# EAGLE design ESP_LoRa_Weather_1.55 (EAGLE 9.6.2)
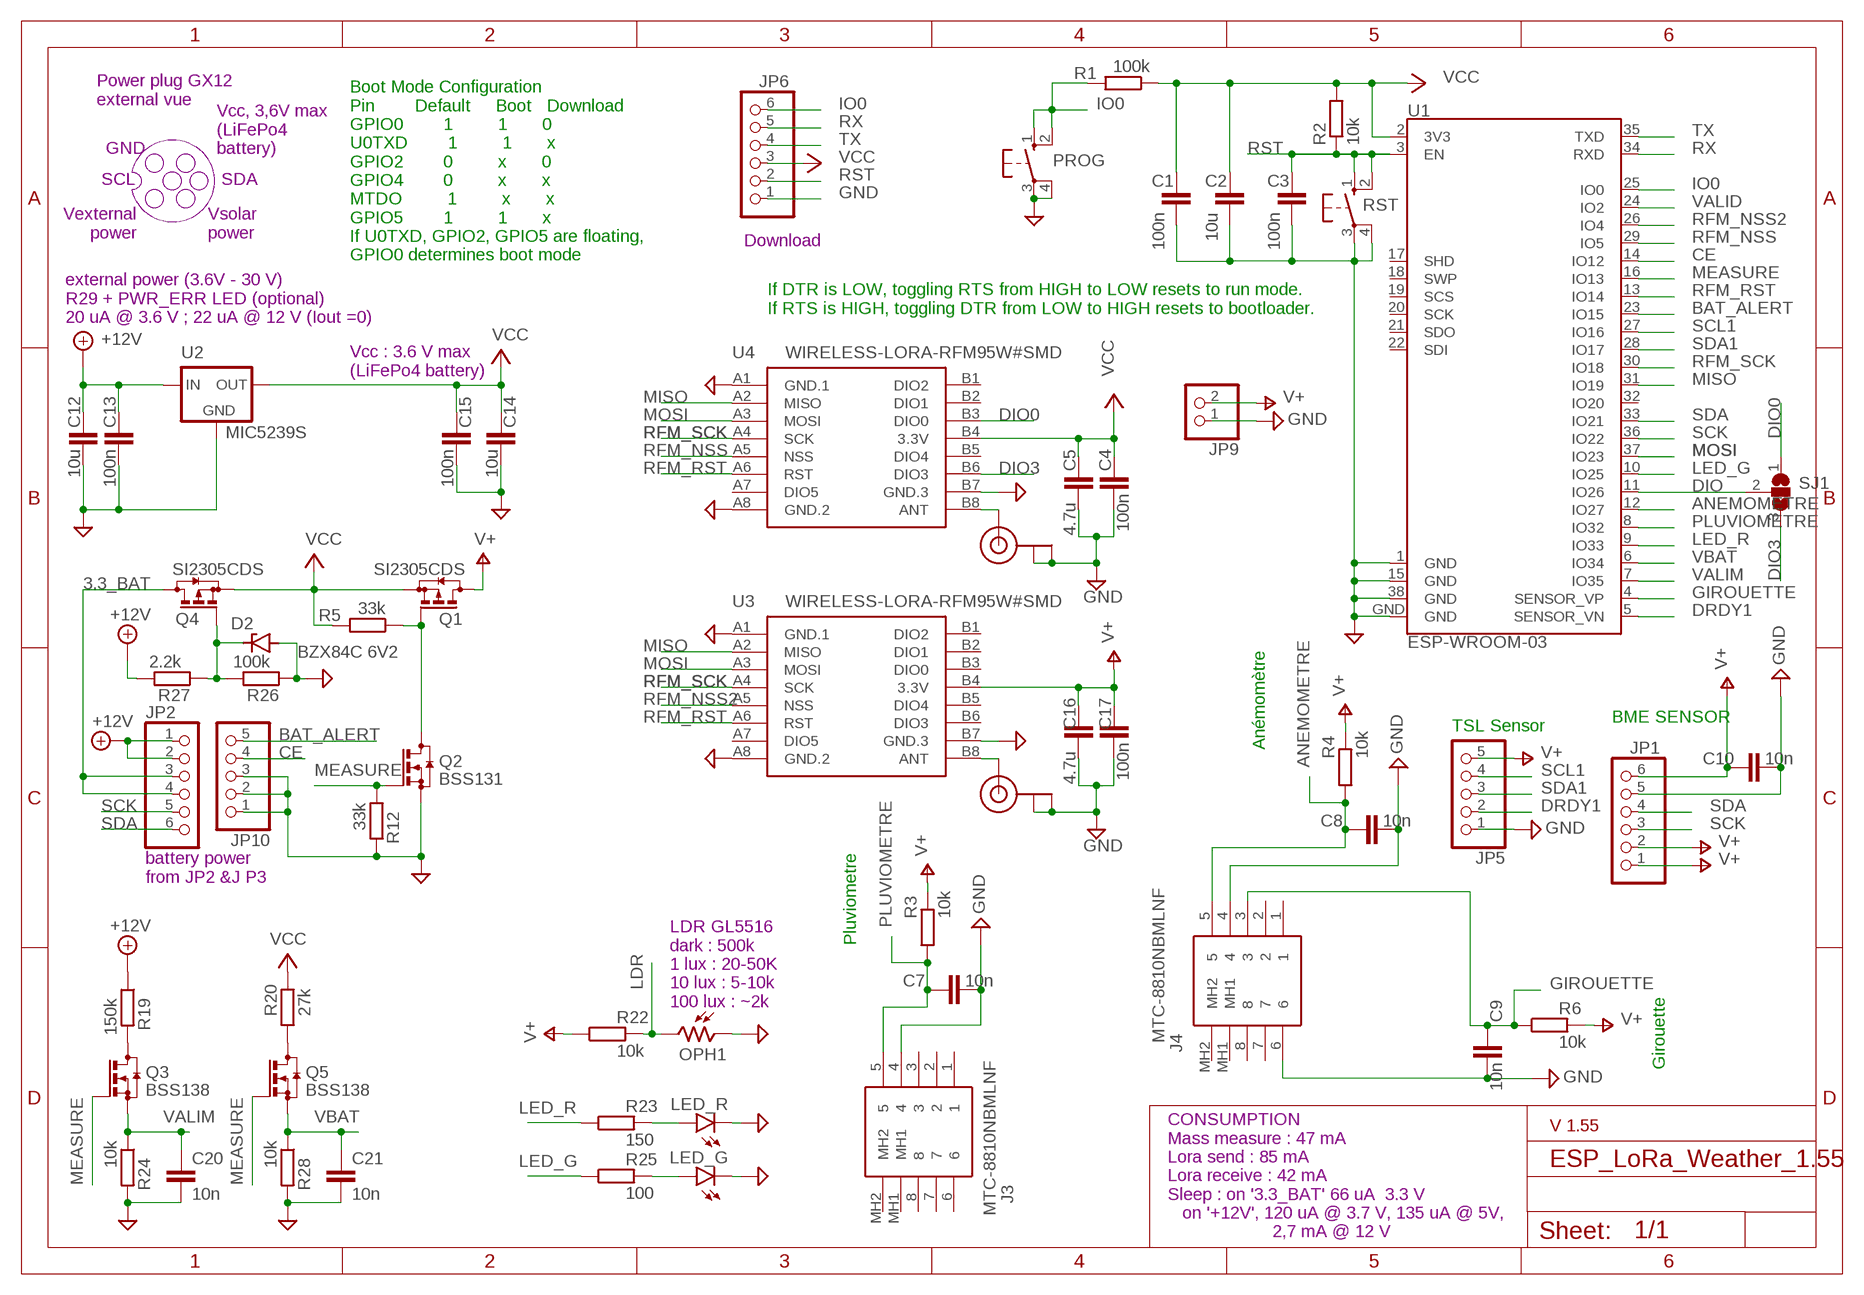
[diagram p0: schematic, sheet 1]

## Parts
C1  100n  CC1206  [C1206]
C2  10u  CC1210  [C1210]
C3  100n  CC1206  [C1206]
C4  100n  CC1206  [C1206]
C5  4.7u  CC1210  [C1210]
C7  10n  CC1206  [C1206]
C8  10n  CC1206  [C1206]
C9  10n  CC1206  [C1206]
C10  10n  CC1206  [C1206]
C12  10u  CC1210  [C1210]
C13  100n  CC1206  [C1206]
C14  10u  CC1210  [C1210]
C15  100n  CC1206  [C1206]
C16  4.7u  CC1210  [C1210]
C17  100n  CC1206  [C1206]
C20  10n  CC1206  [C1206]
C21  10n  CC1206  [C1206]
D2  BZX84C 6V2  BZX84CSMD  [TO236]
J1  U.FL  [U.FL]
J2  U.FL  [U.FL]
J3  MTC-8810NBMLNF  [MTC8810NBMLNF]
J4  MTC-8810NBMLNF  [MTC8810NBMLNF]
JP1  PINHD-1X6  [1X06]
JP2  PINHD-1X6  [1X06]
JP5  PINHD-1X5  [1X05]
JP6  PINHD-1X6  [1X06]
JP9  PINHD-1X2  [1X02]
JP10  PINHD-1X5  [1X05]
LED_G  LEDSMT1206  [1206]
LED_R  LEDSMT1206  [1206]
OPH1  VT93N2  [VT900]
PROG  10-XX  [B3F-10XX]
Q1  SI2305CDS  [SOT23]
Q2  BSS131  [SOT23]
Q3  BSS138  [SOT23]
Q4  SI2305CDS  [SOT23]
Q5  BSS138  [SOT23]
R1  100k  RR1206  [R1206]
R2  10k  RR1206  [R1206]
R3  10k  RR1206  [R1206]
R4  10k  RR1206  [R1206]
R5  33k  RR1206  [R1206]
R6  10k  RR1206  [R1206]
R12  33k  RR1206  [R1206]
R19  150k  RR1206  [R1206]
R20  27k  RR1206  [R1206]
R22  10k  RR1206  [R1206]
R23  150  RR1206  [R1206]
R24  10k  RR1206  [R1206]
R25  100  RR1206  [R1206]
R26  100k  RR1206  [R1206]
R27  2.2k  RR1206  [R1206]
R28  10k  RR1206  [R1206]
RST  10-XX  [B3F-10XX]
SJ1  SJ2W  [SJ_2]
U1  ESP-WROOM-03  [ESP-WROOM-03]
U2  MIC5239S  [SOT223]
U3  WIRELESS-LORA-RFM95W#SMD  [WIRELESS-LORA-RFM95W#SMD]
U4  WIRELESS-LORA-RFM95W#SMD  [WIRELESS-LORA-RFM95W#SMD]

## Nets
3.3_BAT: JP2.3 JP2.4 Q4.3(D)
+12V: C12.1 C13.1 JP2.1 JP2.2 R19.1 R27.2 U2.1(IN)
ANEMOMETRE: C8.1 J4.5 R4.1 U1.12(IO27)
ANT2: J2.3(SIGNAL) U4.B8(ANT)
ANT3: J1.3(SIGNAL) U3.B8(ANT)
BAT_ALERT: JP10.5 U1.23(IO15)
CE: JP10.4 U1.14(IO12)
DIO: SJ1.2 U1.11(IO26)
DIO0: SJ1.1 U4.B3(DIO0)
DIO3: SJ1.3 U4.B6(DIO3)
DRDY1: JP5.2 U1.5(SENSOR_VN)
GIROUETTE: C9.1 J4.3 R6.1 U1.4(SENSOR_VP)
GND: C1.2 C2.2 C3.2 C4.2 C5.2 C7.2 C8.2 C9.2 C10.2 C12.2 C13.2 C14.2 C15.2 C16.2 C17.2 C20.2 C21.2 D2.A J1.1(GND) J1.2(GND) J2.1(GND) J2.2(GND) J3.4 J4.4 J4.6 JP1.5 JP5.1 JP6.1 JP9.1 JP10.1 JP10.2 JP10.3 LED_G.C LED_R.C OPH1.1 PROG.3(P) PROG.4(P1) Q2.2(S) R12.2 R24.2 R26.1 R28.2 RST.3(P) RST.4(P1) U1.1(GND) U1.15(GND) U1.38(GND) U1.GND U2.2(GND) U2.4(GND) U3.A1(GND.1) U3.A8(GND.2) U3.B7(GND.3) U4.A1(GND.1) U4.A8(GND.2) U4.B7(GND.3)
IO0: JP6.6 PROG.1(S) PROG.2(S1) R1.2 U1.25(IO0)
LDR: OPH1.2 R22.2
LED_G: R25.1 U1.10(IO25)
LED_R: R23.1 U1.9(IO33)
MEASURE: Q2.1(G) Q3.1(G) Q5.1(G) R12.1 U1.16(IO13)
MISO: U1.31(IO19) U3.A2(MISO) U4.A2(MISO)
MOSI: U1.37(IO23) U3.A3(MOSI) U4.A3(MOSI)
N$1: Q1.1(G) Q2.3(D) R5.1
N$2: Q3.3(D) R19.2
N$5: Q5.3(D) R20.1
N$7: LED_R.A R23.2
N$8: LED_G.A R25.2
N$35: D2.C Q4.1(G) R26.2 R27.1
PLUVIOMETRE: C7.1 J3.5 R3.1 U1.8(IO32)
RFM_NSS: U1.29(IO5) U4.A5(NSS)
RFM_NSS2: U1.26(IO4) U3.A5(NSS)
RFM_RST: U1.13(IO14) U3.A6(RST) U4.A6(RST)
RFM_SCK: U1.30(IO18) U3.A4(SCK) U4.A4(SCK)
RST: C3.1 JP6.2 R2.1 RST.1(S) RST.2(S1) U1.3(EN)
RX: JP6.5 U1.34(RXD)
SCK: JP1.3 JP2.5 U1.36(IO22)
SCL1: JP5.4 U1.27(IO16)
SDA: JP1.4 JP2.6 U1.33(IO21)
SDA1: JP5.3 U1.28(IO17)
TX: JP6.4 U1.35(TXD)
V+: C10.1 C16.1 C17.1 JP1.1 JP1.2 JP1.6 JP5.5 JP9.2 Q1.3(D) R3.2 R4.2 R6.2 R22.1 U3.B4(3.3V)
VALID: U1.24(IO2)
VALIM: C20.1 Q3.2(S) R24.1 U1.7(IO35)
VBAT: C21.1 Q5.2(S) R28.1 U1.6(IO34)
VCC: C1.1 C2.1 C4.1 C5.1 C14.1 C15.1 JP6.3 Q1.2(S) Q4.2(S) R1.1 R2.2 R5.2 R20.2 U1.2(3V3) U2.3(OUT) U4.B4(3.3V)
Unconnected: J3.1 J3.2 J3.3 J3.6 J3.7 J3.8 J3.MH1 J3.MH2 J4.1 J4.2 J4.7 J4.8 J4.MH1 J4.MH2 U1.17(SHD) U1.18(SWP) U1.19(SCS) U1.20(SCK) U1.21(SDO) U1.22(SDI) U1.32(IO20) U3.A7(DIO5) U3.B1(DIO2) U3.B2(DIO1) U3.B3(DIO0) U3.B5(DIO4) U3.B6(DIO3) U4.A7(DIO5) U4.B1(DIO2) U4.B2(DIO1) U4.B5(DIO4)

## Notes on the sheet
- Power plug GX12
  external vue
- GND
- Vcc, 3,6V max
  (LiFePo4
  battery)
- SCL | SDA
- Download
- Vexternal
  power
- Vsolar 
  power
- Boot Mode Configuration
  Pin        Default     Boot   Download
  GPIO0        1         1       0
  U0TXD        1         1       x
  GPIO2        0         x       0
  GPIO4        0         x       x
  MTDO         1         x       x
  GPIO5        1         1       x
  If U0TXD, GPIO2, GPIO5 are floating, 
  GPIO0 determines boot mode
- If DTR is LOW, toggling RTS from HIGH to LOW resets to run mode.
  If RTS is HIGH, toggling DTR from LOW to HIGH resets to bootloader.
- external power (3.6V - 30 V)
  R29 + PWR_ERR LED (optional)
  20 uA @ 3.6 V ; 22 uA @ 12 V (Iout =0)
- Vcc : 3.6 V max 
  (LiFePo4 battery)
- BME SENSOR
- TSL Sensor
- Anémomètre
- battery power
  from JP2 &J P3
- Pluviometre
- LDR GL5516
  dark : 500k
  1 lux : 20-50K
  10 lux : 5-10k
  100 lux : ~2k
- Girouette
- V 1.55
- CONSUMPTION
  Mass measure : 47 mA
  Lora send : 85 mA
  Lora receive : 42 mA
  Sleep : on '3.3_BAT' 66 uA  3.3 V
     on '+12V', 120 uA @ 3.7 V, 135 uA @ 5V,
                       2,7 mA @ 12 V

## Library data of the parts
C1-C5 C7-C10 C12-C17 C20 C21 = eagle-ltspice:C: CAPACITOR, European symbol; SPICEMODEL: NONE; SPICEPREFIX: C
D2 = diode:BZX84CSMD: Z DIODE
J1 J2 = microbuilder:U.FL: U.FL Antenna Connector
J3 J4 = SamacSys_Parts:MTC-8810NBMLNF: RS PRO Female Cat5 RJ45 Connector, PCB Mount RS Pro Cat5 RJ45 Connector Socket, Unshielded, Right Angle, PCB Mount Source: Datasheet <https://docs.rs-online.com/6e50/0900766b815bdd23.pdf>; DESCRIPTION: RS PRO Female Cat5 RJ45 Connector, PCB Mount RS Pro Cat5 RJ45 Connector Socket, Unshielded, Right Angle, PCB Mount; HEIGHT: 14.5mm; MANUFACTURER_NAME: RS Components; MANUFACTURER_PART_NUMBER: MTC-8810NBMLNF
JP1 JP2 JP6 = pinhead:PINHD-1X6: PIN HEADER
JP5 JP10 = pinhead:PINHD-1X5: PIN HEADER
JP9 = pinhead:PINHD-1X2: PIN HEADER
LED_G LED_R = led:LED: LED OSRAM: - CHIPLED LG R971, LG N971, LY N971, LG Q971, LY Q971, LO R971, LY R971 LH N974, LH R974 LS Q976, LO Q976, LY Q976 LO Q996 - Hyper CHIPLED LW Q18S LB Q993, LB Q99A, LB R99A - SideLED LS A670, LO A670, LY A670, LG A670, LP A670 LB A673, LV A673, LT A673, LW A673 LH A674 LY A675 LS A676, LA A676, LO A676, LY A676, LW A676 LS A679, LY A679, LG A679 - Hyper Micro SIDELED® LS Y876, LA Y876, LO Y876, LY Y876 LT Y87S - SmartLED LW L88C, LW L88S LB L89C, LB L89S, LG L890 LS L89K, LO L89K, LY L89K LS L896, LA L896, LO L896, LY L896 - TOPLED LS T670, LO T670, LY T670, LG T670, LP T670 LSG T670, LSP T670, LSY T670, LOP T670, LYG T670 LG T671, LOG T671, LSG T671 LB T673, LV T673, LT T673, LW T673 LH T674 LS T676, LA T676, LO T676, LY T676, LB T676, LH T676, LSB T676, LW T676 LB T67C, LV T67C, LT T67C, LS T67K, LO T67K, LY T67K, LW E67C LS E67B, LA E67B, LO E67B, LY E67B, LB E67C, LV E67C, LT E67C LW T67C LS T679, LY T679, LG T679 LS T770, LO T770, LY T770, LG T770, LP T770 LB T773, LV T773, LT T773, LW T773 LH T774 LS E675, LA E675, LY E675, LS T675 LS T776, LA T776, LO T776, LY T776, LB T776 LHGB T686 LT T68C, LB T68C - Hyper Mini TOPLED® LB M676 - Mini TOPLED Santana® LG M470 LS M47K, LO M47K, LY M47K Source: http://www.osram.convergy.de LUXEON: - LUMILED® LXK2-PW12-R00, LXK2-PW12-S00, LXK2-PW14-U00, LXK2-PW14-V00 LXK2-PM12-R00, LXK2-PM12-S00, LXK2-PM14-U00 LXK2-PE12-Q00, LXK2-PE12-R00, LXK2-PE12-S00, LXK2-PE14-T00, LXK2-PE14-U00 LXK2-PB12-K00, LXK2-PB12-L00, LXK2-PB12-M00, LXK2-PB14-N00, LXK2-PB14-P00, LXK2-PB14-Q00 LXK2-PR12-L00, LXK2-PR12-M00, LXK2-PR14-Q00, LXK2-PR14-R00 LXK2-PD12-Q00, LXK2-PD12-R00, LXK2-PD12-S00 LXK2-PH12-R00, LXK2-PH12-S00 LXK2-PL12-P00, LXK2-PL12-Q00, LXK2-PL12-R00 Source: www.luxeon.com KINGBRIGHT: KA-3528ASYC Source: www.kingbright.com
OPH1 = photo-elements:VT9: Photoconductive Cell VT900 Series Source: http://optoelectronics.perkinelmer.com/content/Datasheets/DTS_vt900seriesdatasheet.pdf
PROG RST = switch-omron:10-XX: OMRON SWITCH; MPN: B3F-1000; OC_FARNELL: 176432; OC_NEWARK: 36M3542
Q1 Q4 = transistor-small-signal-perso:SI2305CDS: P-CHANNEL MOS FET
Q2 = transistor-small-signal-perso:BSS131: N-CHANNEL MOS FET
Q3 Q5 = detect:BSS138: N-CHANNEL MOS FET
R1-R6 R12 R19 R20 R22-R28 = eagle-ltspice:R: RESISTOR, European symbol; SPICEMODEL: NONE; SPICEPREFIX: R
SJ1 = jumper:SJ2W: SMD solder JUMPER
U1 = esp32-sparkfun (1):ESP-WROOM-03; OC_FARNELL: unknown
U2 = micrel:MIC5239S: LDO REGULATOR
U3 U4 = diy-modules:WIRELESS-LORA-RFM95W: 868/915 MHz LoRa Radio Transceiver Module based on SX1276 chip Click here to find device on ebay.com <http://www.ebay.com/sch/RFM95W+transceiver>

## Board
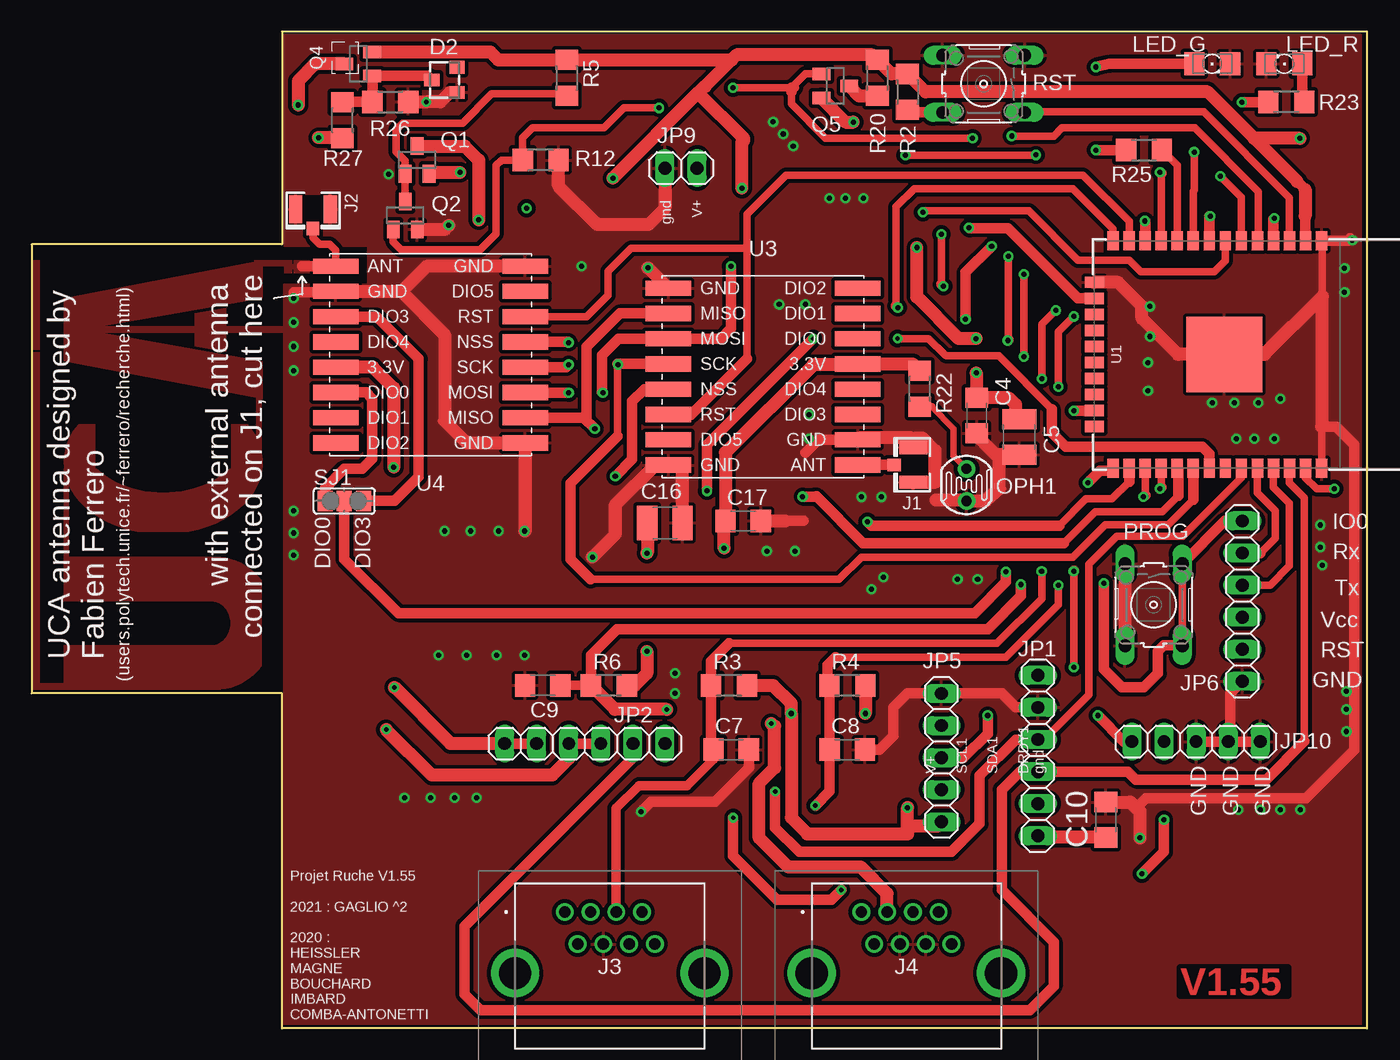
[diagram p1: board, top side]
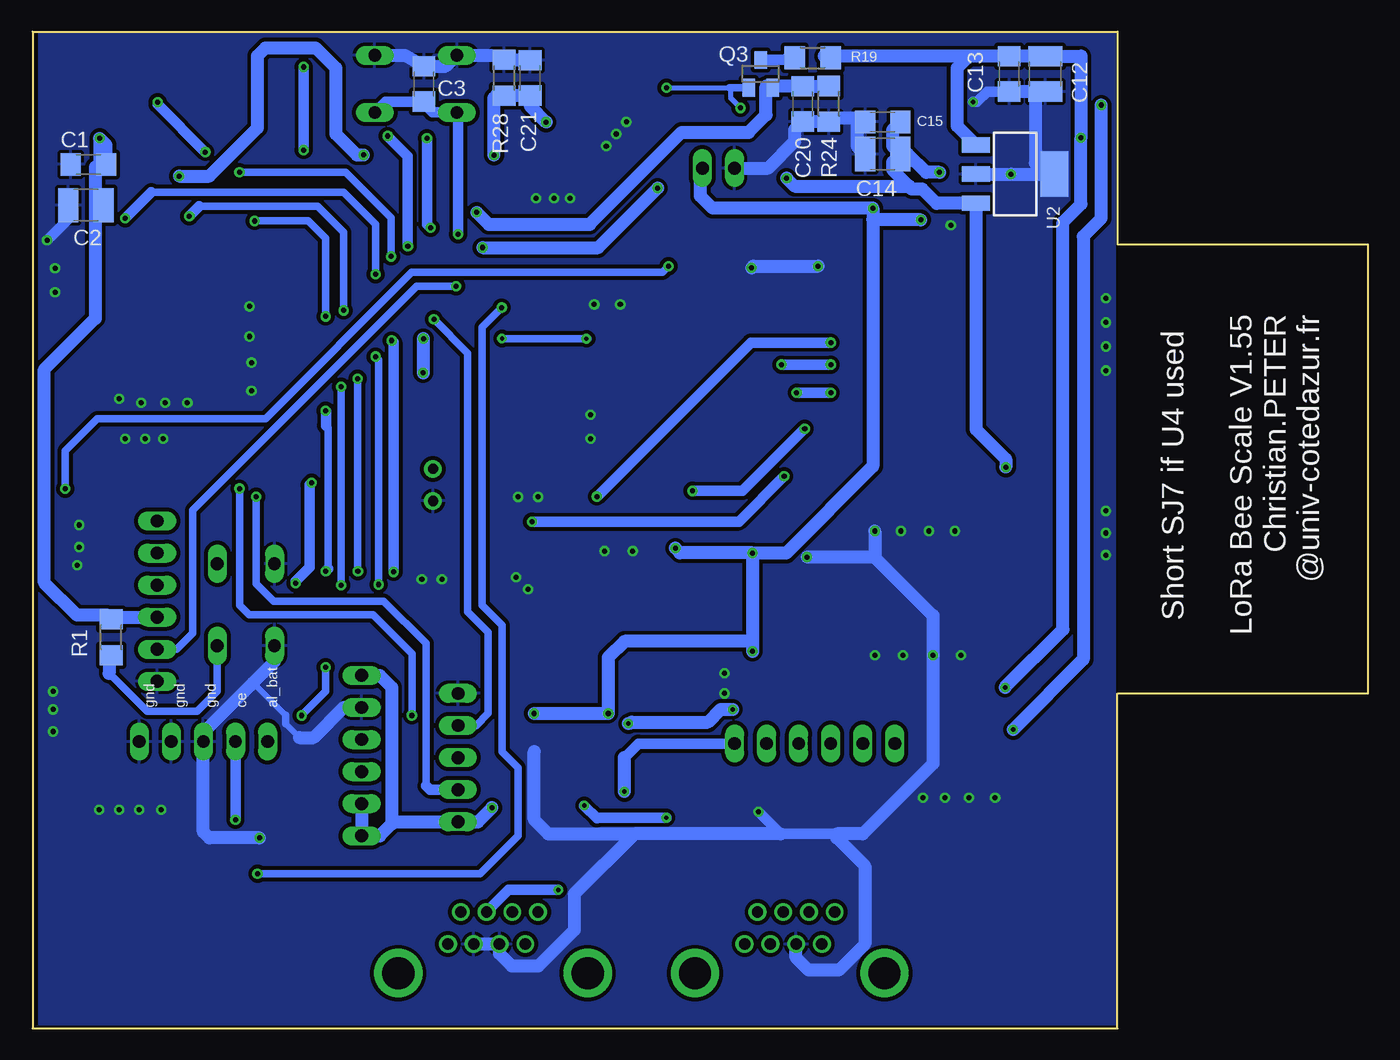
[diagram p2: board, bottom side, seen from below]

Size 105.76 x 78.91 mm. Coordinates in mm from the lower left corner, seen from the top.
Outline: 19.84,0 19.84,26.51 0,26.51 0,62.07 19.84,62.07 19.84,78.91 105.76,78.91 105.76,0 19.84,0
Copper layers (1*16): Top 0.035mm / dielectric 1.5mm / Bottom 0.035mm
Design rules "default *": minimum track width 6mil, minimum drill 0.35mm, track to track 12mil, track to pad 6mil, pad to pad 6mil, via to via 6mil, smd to smd 6mil, copper to edge 0mil, drill to drill 6mil, minimum pad ring 10mil, minimum via ring 8mil, stop-mask expansion 4mil, vias tented up to drill 0mil, thermal gap 10mil

### Footprints (pad centres in the part's own frame; a part is rotated, then mirrored left to right if it is on the bottom)
C1206 = smd 1.6 x 1.8: 1 -1.4,0; 2 1.4,0
C1210 = smd 1.6 x 2.7: 1 -1.4,0; 2 1.4,0
TO236 = smd 1 x 1.2: A -1,-1; C 0,1; NC 1,-1
U.FL = smd 2.2 x 1.05: 1 0,1.375; 2 0,-1.375 | smd 1.05 x 1: 3 1.525,0
MTC8810NBMLNF = drill 0.9 pad 1.4: 1 0,0; 2 1.02,-2.54; 3 2.04,0; 4 3.06,-2.54; 5 4.08,0; 6 5.1,-2.54; 7 6.12,0; 8 7.14,-2.54 | drill 2.55 pad 3.825: MH1 -3.93,-4.84; MH2 11.07,-4.84
1X06 = drill 1.016 long: 1 -6.35,0; 2 -3.81,0; 3 -1.27,0; 4 1.27,0; 5 3.81,0; 6 6.35,0
1X05 = drill 1.016 long: 1 -5.08,0; 2 -2.54,0; 3 0,0; 4 2.54,0; 5 5.08,0
1X02 = drill 1.016 long: 1 -1.27,0; 2 1.27,0
1206 = smd 1.6 x 1.803: A -1.422,0; C 1.422,0
VT900 = drill 0.8 pad 1.4: 1 -1.27,0; 2 1.27,0
B3F-10XX = drill 1.016 long: 1 -3.251,2.261; 2 3.251,2.261; 3 -3.251,-2.261; 4 3.251,-2.261
SOT23 = smd 1 x 1.4: 1 -0.95,-1.1; 2 0.95,-1.1; 3 0,1.1
R1206 = smd 1.6 x 1.803: 1 -1.422,0; 2 1.422,0
SJ_2 = smd 1.168 x 1.6: 1 -1.524,0; 2 0,0; 3 1.524,0
ESP-WROOM-03 = smd 0.9 x 1.5: 1 7.7,9; 2 6.43,9; 3 5.16,9; 4 3.89,9; 5 2.62,9; 6 1.35,9; 7 0.08,9; 8 -1.19,9; 9 -2.46,9; 10 -3.73,9; 11 -5,9; 12 -6.27,9; 13 -7.54,9; 14 -8.81,9; 25 -8.81,-9; 26 -7.54,-9; 27 -6.27,-9; 28 -5,-9; 29 -3.73,-9; 30 -2.46,-9; 31 -1.19,-9; 32 0.08,-9; 33 1.35,-9; 34 2.62,-9; 35 3.89,-9; 36 5.16,-9; 37 6.43,-9; 38 7.7,-9 | smd 1.5 x 0.9: 15 -10.3,5.715; 16 -10.3,4.445; 17 -10.3,3.175; 18 -10.3,1.905; 19 -10.3,0.635; 20 -10.3,-0.635; 21 -10.3,-1.905; 22 -10.3,-3.175; 23 -10.3,-4.445; 24 -10.3,-5.715 | smd 6 x 6: GND 0,0
SOT223 = smd 1.219 x 2.235: 1 -2.311,-3.099; 2 0,-3.099; 3 2.311,-3.099 | smd 3.6 x 2.2: 4 0,3.099
WIRELESS-LORA-RFM95W#SMD = smd 3.6 x 1.2: A1 -7.5,7; A2 -7.5,5; A3 -7.5,3; A4 -7.5,1; A5 -7.5,-1; A6 -7.5,-3; A7 -7.5,-5; A8 -7.5,-7; B1 7.5,7; B2 7.5,5; B3 7.5,3; B4 7.5,1; B5 7.5,-1; B6 7.5,-3; B7 7.5,-5; B8 7.5,-7

### Placement (x,y rotation side)
C1  101.34,68.39 180 bottom
C2  101.55,65.17 180 bottom
C3  74.77,74.77 90 bottom
C4  74.86,48.52 270 top
C5  78.22,46.81 270 top
C7  55.4,22.07 0 top
C8  64.61,22.07 0 top
C9  40.48,27.15 180 top
C10  85.09,16.51 90 top
C12  25.56,75.56 270 bottom
C13  28.42,75.56 270 bottom
C14  38.42,69.22 180 bottom
C15  38.42,71.75 180 bottom
C16  50.17,40.01 0 top
C17  56.36,40.16 0 top
C20  44.77,73.18 270 bottom
C21  66.36,75.25 90 bottom
D2  32.7,75.09 90 top
J1  69.85,44.61 180 top
J2  22.29,64.84 270 top
J3  42.23,9.21 0 top
J4  65.72,9.21 0 top
JP1  79.69,21.59 90 top
JP2  43.81,22.54 0 top
JP5  72.07,21.43 270 top
JP6  95.89,33.81 90 top
JP9  51.44,68.1 0 top
JP10  92.23,22.7 180 top
LED_G  93.5,76.36 0 top
LED_R  99.22,76.36 180 top
OPH1  74.05,43.02 90 top
PROG  88.87,33.53 270 top
Q1  30.53,68.75 0 top
Q2  29.6,64.35 0 top
Q3  48.1,75.56 0 bottom
Q4  25.88,76.36 90 top
Q5  63.66,74.61 270 top
R1  99.54,30.96 270 bottom
R2  69.37,74.14 90 top
R3  55.25,27.15 0 top
R4  64.61,27.15 0 top
R5  42.39,75.25 90 top
R6  45.72,27.15 0 top
R12  40.32,68.74 0 top
R19  43.97,76.84 180 bottom
R20  66.99,75.25 90 top
R22  70.34,50.63 270 top
R23  99.38,73.34 0 top
R24  42.7,73.18 270 bottom
R25  88.11,69.53 180 top
R26  28.42,73.34 180 top
R27  24.62,71.89 270 top
R28  68.42,75.25 90 bottom
RST  75.41,74.77 180 top
SJ1  24.77,41.75 0 top
U1  94.47,53.35 0 top
U2  27.94,67.63 270 bottom
U3  57.94,51.59 0 top
U4  31.59,53.34 180 top

### Tracks (layer width: path | path; a pad name or v marks a point on that pad's centre or on a via)
3.3_BAT  (via drill 0.35, 0.4)
  Top 0.813: JP2.3 JP2.4
  Top 1.016: Q4.3 22.54,76.36 22.51,76.39 21.11,74.99 v21.11,73.1 | JP2.3 42.54,21.36 41.23,20.04 31.71,20.04 v28.1,23.65
  Bottom 1.016: v21.11,73.1 21.11,64.14 22.54,62.71 22.54,29.21 v28.1,23.65
+12V  (via drill 0.35, 0.4)
  Top 0.813: JP2.2 JP2.1 | R27.2 24.57,70.52
  Top 1.016: 24.57,70.52 v22.73,70.52 | JP2.1 33.18,22.54 v28.73,26.99
  Bottom 1.016: 31.59,76.97 C13.1 C12.1 22.73,76.97 v22.73,70.52 22.73,65.25 24.15,63.82 24.15,31.57 v28.73,26.99 | 31.59,76.97 43.06,76.97 42.93,76.84 R19.1 | U2.1 32.54,71.44 32.54,76.01 31.59,76.97
ANEMOMETRE  (via drill 0.35, 0.4)
  Top 0.61: v81.31,35.08 81.31,33.53 77.15,29.37 63.66,29.37 | v82.55,56.36 81.32,55.13 v81.32,50.8
  Top 0.813: 63.66,29.37 63.02,28.73 63.02,27.31 R4.1 63.19,22.09 C8.1 63.21,18.76 v62.07,17.62 | v88.17,63.92 88.2,63.89 U1.12 | v64.14,10.95 63.34,10.16 59.06,10.16 55.56,13.65 v55.56,16.67
  Bottom 0.61: 81.31,50.79 v81.31,35.08 | v82.55,56.36 82.55,62.55 83.92,63.92 v88.17,63.92
  Bottom 0.813: v81.32,50.8 81.31,50.79 | v62.07,17.62 61.07,16.62 61.02,16.67 v55.56,16.67 | v64.14,10.95 68.06,10.95 J4.5
ANT1
  pour Top: 0.64,53.71 0.14,53.71 0.14,60.82 0.64,60.82
ANT2
  Top 0.61: U4.B8 24.09,61.59 23.59,62.09 22.8,62.09 22.29,62.6 J2.3
  Top 0.813: U4.B8 21.45,60.34 21.43,60.33
  pour Top: 14.99,26.81 0.14,26.81 0.14,53.52 0.64,53.52 0.64,27.32 2.54,27.32 2.54,30.31 14.19,30.31 14.32,30.32 14.46,30.34 14.59,30.37 14.73,30.42 14.85,30.48 14.97,30.55 15.09,30.63 15.2,30.72 15.3,30.83 15.39,30.94 15.48,31.06 15.55,31.19 15.61,31.33 15.67,31.47 15.71,31.61 15.74,31.76 15.76,31.91 15.76,32.06 15.76,32.22 15.74,32.37 15.71,32.52 15.67,32.66 15.61,32.8 15.55,32.94 15.48,33.07 15.39,33.19 15.3,33.3 15.2,33.4 15.09,33.5 14.97,33.58 14.85,33.65 14.73,33.71 14.59,33.75 14.46,33.79 14.32,33.81 14.19,33.82 2.54,33.82 2.54,44.32 2.57,44.32 2.55,44.92 2.61,45.54 2.75,46.13 2.99,46.74 3.31,47.3 3.72,47.81 5.03,47.81 5.03,44.32 5.17,44.32 5.5,44.02 5.85,43.76 6.22,43.52 6.63,43.29 7.06,43.09 7.5,42.91 7.96,42.76 8.44,42.63 8.92,42.54 9.42,42.47 9.92,42.42 10.42,42.41 10.92,42.42 11.42,42.47 11.92,42.54 12.41,42.63 12.88,42.76 13.35,42.91 13.78,43.09 14.21,43.29 14.62,43.52 14.99,43.76 15.34,44.02 15.67,44.32 15.82,44.32 15.82,47.81 17.13,47.81 17.25,47.66 17.37,47.51 17.49,47.34 17.59,47.18 17.69,47.02 17.79,46.85 17.79,49.91 2.54,52.81 2.54,57.81 17.64,60.69 17.64,60.82 20.14,60.82 20.14,60.81 20.64,60.81 20.64,60.48 20.76,60.48 20.76,60.8 22.54,60.8 22.54,59.79 20.77,59.79 20.77,60.11 20.64,60.11 20.64,59.8 19.99,59.8 19.99,60.31 18.31,60.31 18.31,57.81 5.61,55.57 12.91,55.57 12.91,56.61 15.4,57.06 15.4,55.57 19.99,55.57 19.99,55.81 20.39,55.81 20.39,54.81 19.99,54.81 19.99,55.06 15.4,55.06 15.4,53.56 14.21,53.78 13.08,53.95 13.08,53.99 12.91,54.01 12.91,55.06 5.61,55.06 18.31,52.81 18.31,49.81 18.24,49.83 18.24,45.57 18.3,45.03 18.29,44.48 18.21,43.94 18.06,43.39 17.83,42.87 17.55,42.37 17.18,41.88 16.76,41.43 16.3,41.01 15.76,40.61 15.17,40.27 14.57,39.96 13.89,39.69 13.2,39.47 12.49,39.31 8.35,39.31 7.75,39.45 7.15,39.62 6.57,39.84 6.03,40.08 5.51,40.35 5.02,40.67 4.58,40.99 4.16,41.34 3.79,41.73 3.47,42.13 3.19,42.55 2.95,42.99 2.95,37.32 14.99,37.32 14.99,37.3 15.4,37.24 15.81,37.15 16.21,37.02 16.59,36.84 16.96,36.63 17.31,36.39 17.65,36.11 17.96,35.8 18.24,35.46 18.24,28.66 17.96,28.33 17.65,28.02 17.31,27.74 16.96,27.5 16.59,27.28 16.21,27.11 15.81,26.98 15.4,26.88 14.99,26.83
ANT3
  Top 0.813: U3.B8 J1.3
BAT_ALERT  (via drill 0.4)
  Top 0.61: v82.55,28.58 82.55,36.21
  Top 0.813: JP10.5 86.52,22.7 v84.45,24.76 | 82.55,36.21 v82.53,36.19 | U1.23 84.16,48.9 v82.55,48.9
  Bottom 0.61: v84.45,24.76 82.55,26.67 v82.55,28.58 | 82.52,47.72 82.36,47.56 82.36,36.37
  Bottom 0.813: v82.53,36.19 82.36,36.37 | 82.52,47.72 82.52,48.87 v82.55,48.9
CE  (via drill 0.4)
  Top 0.61: U1.14 85.66,63.3 82.48,66.47 69.92,66.47 68.48,65.03 68.48,57.19
  Top 0.813: v68.6,57.06 68.48,57.19 | v89.69,16.51 89.69,13.97 v87.95,12.22
  Bottom 0.61: v68.6,57.06 70.17,55.5 70.17,33.5 68.58,31.91 68.58,21.91 67.31,20.64 67.31,15.24 70.33,12.22 v87.95,12.22
  Bottom 0.813: v89.69,16.51 JP10.4
DIO  (via drill 0.4)
  Top 0.61: 89.47,67.7 U1.11 | v77.35,61.11 77.35,54.49
  Top 0.813: SJ1.2 24.77,37.15 29.05,32.86 74.69,32.86 77.17,35.34 v77.17,36.13 | v89.38,67.79 89.47,67.7 | 77.35,54.49 v77.31,54.45
  Bottom 0.61: v89.38,67.79 80.96,67.79 77.35,64.18 v77.35,61.11
  Bottom 0.813: v77.31,54.45 77.17,54.31 v77.17,36.13
DIO0
  Top 0.813: 23.18,41.75 SJ1.1 23.24,42.77 24.77,44.29 26.19,44.29 26.99,45.08 26.99,49.85 26.5,50.34 U4.B3
DIO3
  Top 0.813: SJ1.3 28.73,41.75 30.67,43.68 30.67,52.99 27.32,56.34 U4.B6
DRDY1  (via drill 0.4)
  Top 0.61: 97.15,62.42 97.15,66.24 92.12,71.28 81.6,71.28 80.96,70.64 v77.63,70.64
  Top 0.813: U1.5 97.15,62.42 | v76.04,61.91 73.98,59.85 v73.98,56.13
  Bottom 0.61: v73.98,56.13 71.29,53.44 71.29,32.96 69.67,31.34 69.67,24.92 70.62,23.97 JP5.2
  Bottom 0.813: v77.63,70.64 76.04,69.06 v76.04,61.91
GIROUETTE  (via drill 0.35, 0.4)
  Top 0.61: v78.58,59.69 v78.58,53.18
  Top 0.762: C9.1 R6.1
  Top 0.813: R6.1 44.3,29.53 46.36,31.59 75.72,31.59 78.36,34.23 v78.36,35.13 | v98.42,64.14 98.36,64.07 U1.4
  Top 1.016: J4.3 67.76,10.66 65.67,12.75 59.96,12.75 57.63,15.08 57.63,19.39 58.85,20.61 58.85,23.92 58.81,23.9 v58.58,24.13 | v50.32,25.24 46.2,25.24 R6.1
  Bottom 0.61: v78.36,35.13 78.36,52.92 78.58,53.14 v78.58,53.18 | 96.36,66.2 81.13,66.2 78.58,63.65 v78.58,59.69
  Bottom 0.813: 96.36,66.2 v98.42,64.14
  Bottom 1.016: v58.58,24.13 58.31,24.24 52.28,24.24 51.28,25.24 v50.32,25.24
GND  (via drill 0.35, 0.4)
  Top 0.61: U1.1 102.24,62.28 102.24,57.95 | 102.17,47.62 U1.38
  Top 0.813: JP6.1 94.93,26.51 94.93,22.86 JP10.2 | JP10.2 JP10.1 | JP10.2 JP10.3 | JP1.5 77.95,25.4 76.84,26.51 JP5.1 69.37,26.51 68.26,25.4 68.26,23.18 67.15,22.07 C8.2 | U3.B7 62.31,46.59 61.28,45.56 | 59.69,40.16 61.12,40.16 | 102.17,47.62 103.35,47.62 104.78,46.2 104.78,22.07 100.9,18.2 88.24,18.2 87.49,17.44 | U1.1 104.26,62.35 104.46,62.55 v104.62,62.39 | U4.B7 24.01,58.26 20.8,58.26 20.76,58.23 v20.76,57.79 | v48.26,17.14 49.05,17.94 54.13,17.94 56.83,20.64 56.83,22.04 C7.2
  Top 1.016: C16.2 51.57,44.42 51.59,44.45 51.45,44.59 U3.A8 49.4,44.59 46.24,41.43 46.24,39.13 v44.42,37.31 | U4.B7 29.29,58.34 | 29.29,58.34 32.7,54.93 32.7,48.1 34.46,46.34 U4.A1 39.09,39.41 v39.05,39.37 | U4.A8 39.08,60.33 31.28,60.33 29.29,58.34 | 102.17,57.87 97.64,53.35 U1.GND 90.8,53.35 87.95,56.2 87.95,57.15 86.03,59.06 U1.15 | 102.17,57.87 102.24,57.95 | 102.17,57.87 102.17,47.62 | J1.2 69.85,46.51 | U3.B7 65.62,46.77 69.59,46.77 69.85,46.51 | C10.2 87.02,17.91 87.49,17.44 | 87.79,17.14 v87.79,15.08 | PROG.3 PROG.4 | JP9.1 50.17,64.93 48.86,63.62 44.81,63.62 41.74,66.68 R12.2 | U3.A1 48.83,60.21 v48.81,60.21 | D2.A 33.13,74.09 32.38,73.34 v31.27,73.34 R26.1 | 71.64,41.81 73.99,41.81 OPH1.1 75.55,41.75 76.67,42.75 76.67,45.16 76.75,45.23 | C4.2 74.95,47.02 74.95,46.83 76.39,45.39 78.2,45.39 C5.2 | 69.85,46.51 70.08,46.74 70.54,46.74 71.56,45.73 71.56,43.88 71.6,43.84 71.6,43.23 J1.1 | Q2.2 32.69,63.25 32.73,63.25 v33.04,63.57 | C17.2 59.69,40.16
  Bottom 0.508: 88.3,27.34 85.73,24.76 | 85.73,24.13 84.61,23.02
  Bottom 0.61: 85.73,24.76 85.73,24.13
  Bottom 0.813: C2.2 102.95,64.06 v104.62,62.39 | C13.2 30.13,74.17 30.96,73.34 v31.27,73.34 | v48.26,17.14 46.51,15.4 42.07,15.4 | 45.4,6.55 J3.4
  Bottom 1.016: JP9.1 47.51,68.1 45.4,70.22 45.4,71.15 44.79,71.76 R24.2 42.38,71.76 42.07,72.07 40.77,72.07 40.45,71.75 40.45,69.85 C14.2 | C13.2 C12.2 26.35,74.01 26.35,68.5 25.48,67.63 v28.28,67.63 U2.2 | C21.2 66.99,76.65 67.01,76.67 R28.2 69.42,77.03 RST.4 73.02,76.17 C3.2 76.27,77.03 RST.3 | PROG.4 86.61,29.04 88.3,27.34 92.23,23.42 JP10.3 92.23,15.56 91.76,15.08 v87.79,15.08 | 84.61,23.02 83.5,23.02 81.12,25.4 JP1.5 | v39.05,39.37 39.05,37.27 | 46.51,15.4 58.1,15.4 | 58.1,15.4 64.93,15.4 66.04,16.51 66.04,21.91 | 39.05,37.27 34.45,32.66 34.45,20.96 40,15.4 42.07,15.4 42.07,15.08 39.85,12.86 39.85,6.67 41.91,4.6 44.29,4.6 45.29,5.6 J3.4 | 39.05,37.27 39.09,37.31 v44.42,37.31 | v48.81,60.21 48.69,60.33 v43.56,60.33 v43.55,60.34 | 58.1,15.4 62.87,10.64 62.87,7.78 65.72,4.92 67.79,4.92 68.78,5.92 J4.4 J4.6
  other vias: 20.76,55.88 20.76,53.98 20.76,52.07 20.76,40.96 20.76,39.21 20.76,37.47 58.23,37.78 60.45,37.78 36.99,39.37 34.77,39.37 32.7,39.37 32.23,29.53 34.45,29.53 36.83,29.53 39.05,29.53 29.53,18.26 31.59,18.26 33.5,18.26 35.24,18.26 50.96,28.1 50.96,26.51 59.21,57.31 61.28,57.31 88.58,57.15 88.58,54.77 88.42,52.7 88.42,50.48 103.98,60.17 103.98,58.26 95.57,17.3 97.31,17.3 98.9,17.3 100.49,17.3 104.14,23.49 104.14,25.24 104.14,26.67 102.23,36.67 102.08,38.1 102.08,39.85 61.56,48.58 61.56,46.67 63.18,65.72 64.45,65.72 65.88,65.72 59.53,70.8 60.33,69.85 58.74,71.75 95.41,46.67 96.84,46.67 98.42,46.67 98.9,49.85 97.16,49.53 95.25,49.53 93.5,49.53 74.93,35.56 73.34,35.56 67.47,35.72 66.52,34.77 67.31,42.07 65.72,42.07
  pour Top (isolate 0.254): 20,0.32 20,58.9 26.67,58.9 26.67,61.91 20.05,61.91 20.05,78.72 105.27,78.7 105.27,0.33 105.29,0.32
  pour Bottom (isolate 0.254): 20,0.3 20,78.75 105.27,78.75 105.27,0.3
IO0  (via drill 0.4)
  Top 0.61: PROG.2 PROG.1
  Top 0.813: U1.25 85.44,44.13 84.61,44.13 v83.66,43.18 | PROG.2 91.08,30.32 89.69,30.32 89.22,29.85 89.22,28.1 88.11,26.99 86.36,26.99 84.92,28.43 v84.92,35.24 | PROG.1 94.51,40.16 JP6.6
  Bottom 0.61: 99.7,28.1 96.68,25.08 92.71,25.08 91.13,26.66 PROG.2
  Bottom 0.813: v84.92,35.24 84.92,35.4 83.82,36.5 83.82,43.02 v83.66,43.18
  Bottom 1.016: R1.2 99.7,29.38 99.7,28.1
LDR
  Top 0.508: 71.29,49.21 73.03,47.48 73.03,45.31 OPH1.2
  Top 0.61: R22.2 71.29,49.21
LED_G
  Top 0.61: R25.1 90.74,68.32 U1.10
LED_R  (via drill 0.4)
  Top 0.61: v92.07,69.37 92.07,66.36 92.01,66.29 U1.9
  Top 0.813: R23.1 97.93,73.32 v95.86,73.32
  Bottom 0.813: v95.86,73.32 95.86,73.16 v92.07,69.37
MEASURE  (via drill 0.4)
  Top 0.61: v74.53,70.46 62.89,70.46 60.17,73.18 60.17,74.14 60.48,74.45 v55.56,74.45 | 60.17,74.45 61.28,75.56 Q5.1 | Q2.1 28.65,62.28 29.27,61.66 35.54,61.66 36.79,62.91 36.79,68.32 37.22,68.74 R12.1 38.9,70.52 39.7,71.32 45.35,71.32 46.9,72.87 v49.69,72.87
  Top 0.813: U1.16 82.86,57.79 77.33,63.32 74.3,63.32 v74.25,63.37 | 60.17,74.45 60.17,74.14 | Q5.1
  Bottom 0.406: v49.69,72.87 50.48,73.66 50.48,74.47 50.58,74.45 v55.56,74.45
  Bottom 0.61: 50.58,74.45 49.06,74.45 Q3.1
  Bottom 0.813: v74.53,70.46 74.53,63.66 v74.25,63.37
MISO  (via drill 0.35, 0.4)
  Top 0.61: 80.8,49.03 76.6,53.23 72.45,53.23 72.38,53.29 72.37,53.29 71.05,54.61 v68.58,54.61
  Top 0.813: U3.A2 46.59,56.59 43.97,53.97 43.97,48.42 43.89,48.34 43.74,48.34 | 43.74,48.34 U4.A2 | v53.5,42.55 53.5,46.2 v61.9,54.59 | v44.61,47.47 43.74,48.34 | U1.31 93.28,45.47 92.71,46.04 81.92,46.04 80.8,47.15 80.8,49.03
  Bottom 0.61: v68.58,54.61 61.75,54.61 61.77,54.59 v61.9,54.59
  Bottom 0.813: v53.5,42.55 49.53,42.55 v44.61,47.47
MOSI  (via drill 0.4)
  Top 0.61: U1.37 100.9,43.6 101.79,42.7 v103.19,42.7
  Top 0.813: v45.24,50.32 45.2,50.37 45.2,53.29 46.5,54.59 U3.A3 54.59,54.59 55.4,55.4 v55.4,60.33 | v42.54,50.32 39.11,50.32 U4.A3
  Bottom 0.61: v55.4,60.33 55.88,59.85 75.72,59.85 87.31,48.26 100.65,48.26 103.19,45.72 v103.19,42.7
  Bottom 0.813: v45.24,50.32 v42.54,50.32
N$1
  Top 0.61: Q2.3 29.58,65.47 Q1.1 29.58,68.67 28.86,69.4 28.86,71.12 29.4,71.67 34.14,71.67 36.45,73.98 42.23,73.98
  Top 0.813: 42.23,73.98 R5.1
N$2
  Bottom 0.813: Q3.3 46.2,76.67 46.03,76.84 R19.2
N$5
  Top 1.016: Q5.3 65.55,73.83 R20.1
N$7
  Top 0.813: LED_R.A 100.64,73.5 R23.2
N$8  (via drill 0.4)
  Top 0.813: LED_G.A 85.37,76.36 v84.28,76.11 | R25.2 v84.3,69.53
  Bottom 0.813: v84.28,76.11 v84.3,69.53
N$35
  Top 0.813: R27.1 24.62,73.34 R26.2 26.99,75.39 Q4.1 31.38,75.41 D2.C
PLUVIOMETRE  (via drill 0.4)
  Top 0.61: 55.23,30.47 76.44,30.47 80,34.03 v80,36.17 | v81.12,56.83 80.01,55.72 v80.01,51.44
  Top 0.762: C7.1 54,21.3 51.91,19.21 48.1,19.21 46.31,17.41 J3.5
  Top 0.813: C7.1 53.82,22.25 R3.1 53.82,29.04 53.82,29.05 55.23,30.47 | U1.8 93.28,64.28 v93.34,64.28
  Bottom 0.61: v80.01,51.44 80.01,36.18 | v81.12,56.83 81.12,63.02 83.17,65.07 92.55,65.07
  Bottom 0.813: v80,36.17 80.01,36.18 | v93.34,64.28 92.55,65.07
RFM_NSS  (via drill 0.4)
  Top 0.61: 81.76,38.42 84.24,40.9 89.55,40.9 90.81,42.16
  Top 0.813: U4.A5 42.5,54.34 v42.54,54.29 | v61.07,42.1 62.03,42.1 62.16,42.12 65.86,38.42 81.76,38.42 | 90.81,42.16 90.81,44.28 U1.29
  Bottom 0.813: v42.54,54.29 48.88,54.29 v61.07,42.1
RFM_NSS2  (via drill 0.4)
  Top 0.61: 81.39,39.79 83.52,41.92 85.58,41.92 86.93,43.27
  Top 0.813: U3.A5 48.53,50.59 47.58,49.64 47.58,45.04 v46.23,43.7 | 81.39,39.79 66.52,39.79 v66.21,40.11 | 86.93,43.27 U1.26
  Bottom 0.813: v46.23,43.7 49.82,40.11 v66.21,40.11
RFM_RST
  Top 0.61: 56.67,53.02 56.67,61.75 | 56.67,61.75 47.47,61.75 45.64,59.93 45.64,58.02 43.96,56.34 U4.A6 | 56.67,61.75 56.67,64.45 59.76,67.54 83.27,67.54 86.93,63.89 U1.13
  Top 0.813: U3.A6 52.25,48.59 56.67,53.02
RFM_SCK  (via drill 0.4)
  Top 0.61: 92.01,41.84 90.05,39.88 85.04,39.88 82.46,37.31 65.72,37.31 63.96,35.55 44.29,35.55 | 46.4,46.88 46.4,52.59
  Top 0.813: U3.A4 46.49,52.59 | 46.49,52.59 46.4,52.59 | 46.49,52.59 v46.45,52.55 | v42.54,52.55 42.34,52.34 U4.A4 | U1.30 92.01,41.84 | 44.29,35.55 42.69,37.15 42.69,43.16 46.4,46.88
  Bottom 0.813: v46.45,52.55 v42.54,52.55
RST  (via drill 0.4)
  Top 0.61: U1.3 99.63,65.76 92.83,72.55 78.7,72.55 | v72.07,62.87 72.07,58.9
  Top 0.813: R2.1 69.58,72.51 RST.2 | RST.1 78.7,72.55 | 72.07,58.9 v72.23,58.74
  Bottom 0.61: v72.23,58.74 72.24,58.75 75.33,58.75 93.08,41 93.08,31.29 94.37,30 JP6.2
  Bottom 0.813: RST.1 77.8,73.37 C3.1 74.77,73.18 74.1,72.51 RST.2 72.04,72.4 72.04,62.87 v72.07,62.87
RX
  Top 0.61: U1.34 97.09,42.39 98.5,40.98 98.5,38.81 97.31,37.62
  Top 0.813: 97.31,37.62 JP6.5
SCK
  Top 0.61: U1.36 99.63,43.18 100.82,41.98 100.82,22.71
  Top 0.813: 100.82,22.71 97.79,19.69 87.47,19.69 86.84,20.32 JP1.3 78.26,20.32 76.84,18.89 76.84,10.95 80.96,6.83 80.96,3.33 79.06,1.43 35.56,1.43 34.29,2.7 34.29,8.1 47.62,21.43 JP2.5
SCL1  (via drill 0.4)
  Top 0.61: U1.27 88.2,42.21
  Top 0.813: 88.2,42.21 v88.06,42.07
  Bottom 0.61: v88.06,42.07 88.06,35.2 86.68,33.81 77.95,33.81 74.61,30.48 74.61,26.92 74.59,26.9 74.59,19.19
  Bottom 0.813: 74.59,19.19 74.29,18.89 JP5.4
SDA  (via drill 0.35)
  Top 0.61: U1.33 95.82,43.59 91.18,38.95 85.94,38.95 83.73,36.74 83.73,26.42 80.17,22.86
  Top 0.813: 80.17,22.86 JP1.4 77.95,22.86 75.09,20 75.09,16.19 72.87,13.97 60.8,13.97 58.9,15.88 v58.9,18.73
  Bottom 0.813: 58.9,21.43 57.79,22.54 JP2.6
  Bottom 1.016: v58.9,18.73 58.9,21.43
SDA1  (via drill 0.4)
  Top 0.61: U1.28 89.47,42.82
  Top 0.813: 89.47,42.82 v89.38,42.73 | v75.72,24.76 75.72,23.34 73.82,21.43 JP5.3
  Bottom 0.61: 75.7,24.78 75.7,29.67 78.78,32.75 88.63,32.75 89.38,33.5 v89.38,42.73
  Bottom 0.813: v75.72,24.76 75.7,24.78
TX
  Top 0.61: U1.35 98.36,42.84 99.62,41.57 99.62,36.6 98.11,35.08 JP6.4
V+  (via drill 0.4)
  Top 1.016: C16.1 48.76,37.65 v48.74,37.62 | v48.74,29.85 48.74,28.1 47.78,27.15 R6.2 | R3.2 58.74,27.15 60.17,25.72 v60.17,24.92 60.17,16.67 61.44,15.4 69.37,15.4 69.37,16.03 | 69.37,16.03 71.76,16.03 JP5.5 | R4.2 v66.03,24.93 v66.04,24.92 | 69.37,16.03 v69.37,17.46 | C10.1 79.82,15.11 JP1.1 | v54.85,38.01 54.85,40.06 C17.1 54.96,45.59 61.91,52.55 65.4,52.55 U3.B4 69.8,52.59 R22.1 | Q1.3 34.3,69.85 35.41,68.74 v35.41,64.01
  Bottom 1.016: JP9.2 52.86,67.95 52.86,65.88 51.91,64.93 v39.21,64.93 39.21,64.05 | JP1.6 78.26,27.94 77.31,26.99 77.31,16.35 | 77.31,16.35 77.31,16.19 78.26,15.24 JP1.1 JP1.2 | v48.74,37.62 48.74,37.65 54.49,37.65 v54.85,38.01 | v48.74,37.62 48.74,30.64 | 48.74,30.64 v48.74,29.85 | 48.74,30.64 58.9,30.64 60.17,29.37 60.17,25.08 | 60.17,25.08 v60.17,24.92 | v66.04,24.92 60.32,24.92 60.17,25.08 | 77.31,16.35 70.48,16.35 v69.37,17.46 | v48.74,37.62 46.06,37.62 39.21,44.48 39.21,64.05 | v35.41,64.01 39.17,64.01 39.21,64.05
VALIM  (via drill 0.4)
  Top 0.61: U1.7 94.55,60.76 93.69,59.9 87.86,59.9 86.96,60.8 82.88,60.8 78.97,64.71 70.7,64.71 v70.59,64.6
  Bottom 1.016: R24.1 43.34,74.61 43.36,74.58 C20.1 47.67,74.58 | 47.67,74.58 47.55,74.47 Q3.2 | v70.59,64.6 69.63,63.64 61.64,63.64 54.36,70.92 49.05,70.92 47.67,72.31 47.67,74.58
VBAT  (via drill 0.4)
  Top 0.61: U1.6 95.82,65.79 v94.14,67.47 | v79.54,69.14 79.5,69.14 79.49,69.14 v69.22,69.14 v69.22,69.13
  Top 1.016: Q5.2 64.47,71.75 v65.09,71.75
  Bottom 1.016: 69.03,73.85 69.01,73.83 69.22,73.67 | v94.14,67.47 91.76,67.47 87.95,71.28 87.95,76.99 87.31,77.63 83.34,77.63 81.76,76.04 81.76,70.8 80.1,69.14 v79.54,69.14 | v69.22,69.13 69.22,73.67 | v65.09,71.75 66.36,73.02 C21.1 68.4,73.85 R28.1 69.06,73.83 69.22,73.67
VCC  (via drill 0.4)
  Top 0.813: 100.23,67.05 100.87,66.41 | 100.87,64.29 100.9,64.27 U1.2
  Top 1.016: 100.87,66.41 100.87,64.29 | 96.82,70.46 100.23,67.05 | 96.82,70.46 93.15,74.14 70.8,74.14 R2.2 68.1,75.56 R20.2 66.59,77.07 55.84,77.07 55.44,76.67 | 52.8,74.07 53.34,74.61 53.34,74.56 55.44,76.67 | 52.8,74.07 v46.04,67.31 | 55.44,76.67 R5.2 36.96,76.67 36.32,77.31 Q4.2 | C5.1 77.95,48.49 77.95,49.37 77.4,49.92 C4.1 74.83,49.95 v74.83,51.89 | v100.45,70.46 96.82,70.46 | v74.81,54.61 73.43,54.61 70.12,57.91 v70.12,61.82 | v56.26,66.52 56.26,70.13 56.42,70.29 56.42,70.45 52.8,74.07 | v28.68,44.42 28.68,50.69 27.03,52.34 U4.B4 | Q1.2 31.59,67.76 v33.93,67.76
  Bottom 1.016: 36.35,66.68 36.13,66.45 35.31,66.45 34.18,65.32 U2.3 31.04,47.42 28.68,45.06 v28.68,44.42 | 36.35,66.68 37.65,67.97 37.65,68.58 C14.1 | C15.1 37.65,71.12 37.65,69.85 C14.1 | JP6.3 99.37,32.54 R1.1 99.86,32.7 102.23,32.7 104.83,35.29 104.83,52.17 100.78,56.21 100.78,64.61 | v46.04,67.31 45.4,66.68 36.35,66.68 | 100.78,64.61 100.78,68.18 100.33,68.39 100.45,68.51 v100.45,70.46 99.94,69.95 C1.1 | v74.81,54.61 74.83,54.58 v74.83,51.89 | v70.12,61.82 60.97,61.82 v56.26,66.52 | v33.93,67.76 35,67.76 36.45,69.22 C14.1 | C2.1 100.71,64.61 100.78,64.61

### Text on the board
Top: V1.55
tNames: gnd / / V+ | with external antenna / connected on J1, cut here | IO0 | Rx | DIO0 | DIO3 | Tx | Vcc | RST | UCA antenna designed by / Fabien Ferrero | (users.polytech.unice.fr/~ferrero/recherche.html) | GND | V+ / / SCL1 / / SDA1 / / DRDY1 / gnd | GND | GND | GND | C10 | Projet Ruche V1.55 / / 2021 : GAGLIO ^2 / / 2020 : / HEISSLER / MAGNE / BOUCHARD / IMBARD / COMBA-ANTONETTI
bNames: LoRa Bee Scale V1.55 / Christian.PETER / @univ-cotedazur.fr | Short SJ7 if U4 used | gnd / / gnd / / gnd / / ce / / al_bat